# Altium schematic sheet ExportPinos.SchDoc
size A4
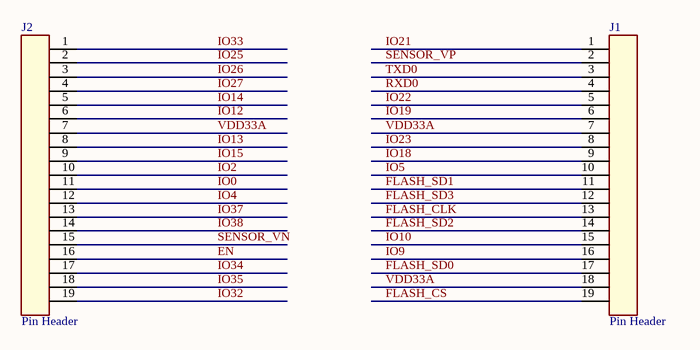
[diagram p0: ExportPinos.SchDoc]

## Parts
J1  Pin Header  [Pin Header 19 Ways]
J2  Pin Header  [Pin Header 19 Ways]

## Nets
EN: J2.16
FLASH_CLK: J1.13
FLASH_CS: J1.19
FLASH_SD0: J1.17
FLASH_SD1: J1.11
FLASH_SD2: J1.14
FLASH_SD3: J1.12
IO0: J2.11
IO2: J2.10
IO4: J2.12
IO5: J1.10
IO9: J1.16
IO10: J1.15
IO12: J2.6
IO13: J2.8
IO14: J2.5
IO15: J2.9
IO18: J1.9
IO19: J1.6
IO21: J1.1
IO22: J1.5
IO23: J1.8
IO25: J2.2
IO26: J2.3
IO27: J2.4
IO32: J2.19
IO33: J2.1
IO34: J2.17
IO35: J2.18
IO37: J2.13
IO38: J2.14
RXD0: J1.4
SENSOR_VN: J2.15
SENSOR_VP: J1.2
TXD0: J1.3
VDD33A: J1.7 J1.18 J2.7

## Library data of the parts
J1 J2 = Pin Header 19 ways: Connector Header PTH 0.100" (2.54mm); Manufacturer 1: Irwin Inc.; Manufacturer 1 PN: M20-9992046